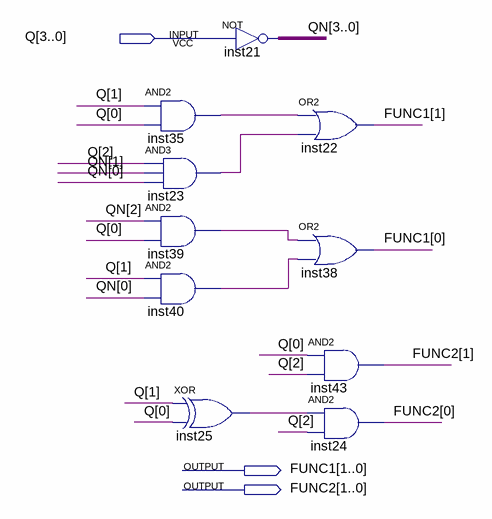
[diagram p0: schematic sheet]
// Quartus schematic FUNC.bdf as structural Verilog: 10 symbols, 3 pins
module FUNC (
  input  [3:0] Q,
  output [1:0] FUNC1,
  output [1:0] FUNC2
);

  wire inst23_out, inst25_out, inst35_out, inst39_out, inst40_out;
  wire [3:0] QN;

  and inst35 (inst35_out, Q[1], Q[0]);
  and inst23 (inst23_out, Q[2], QN[1], QN[0]);
  and inst39 (inst39_out, QN[2], Q[0]);
  and inst40 (inst40_out, Q[1], QN[0]);
  assign QN = ~Q;  // NOT inst21, 4 bits wide
  xor inst25 (inst25_out, Q[1], Q[0]);
  or inst22 (FUNC1[1], inst35_out, inst23_out);
  or inst38 (FUNC1[0], inst39_out, inst40_out);
  and inst43 (FUNC2[1], Q[0], Q[2]);
  and inst24 (FUNC2[0], inst25_out, Q[2]);
endmodule
